# Altium project STC8H1K08.PrjPcb
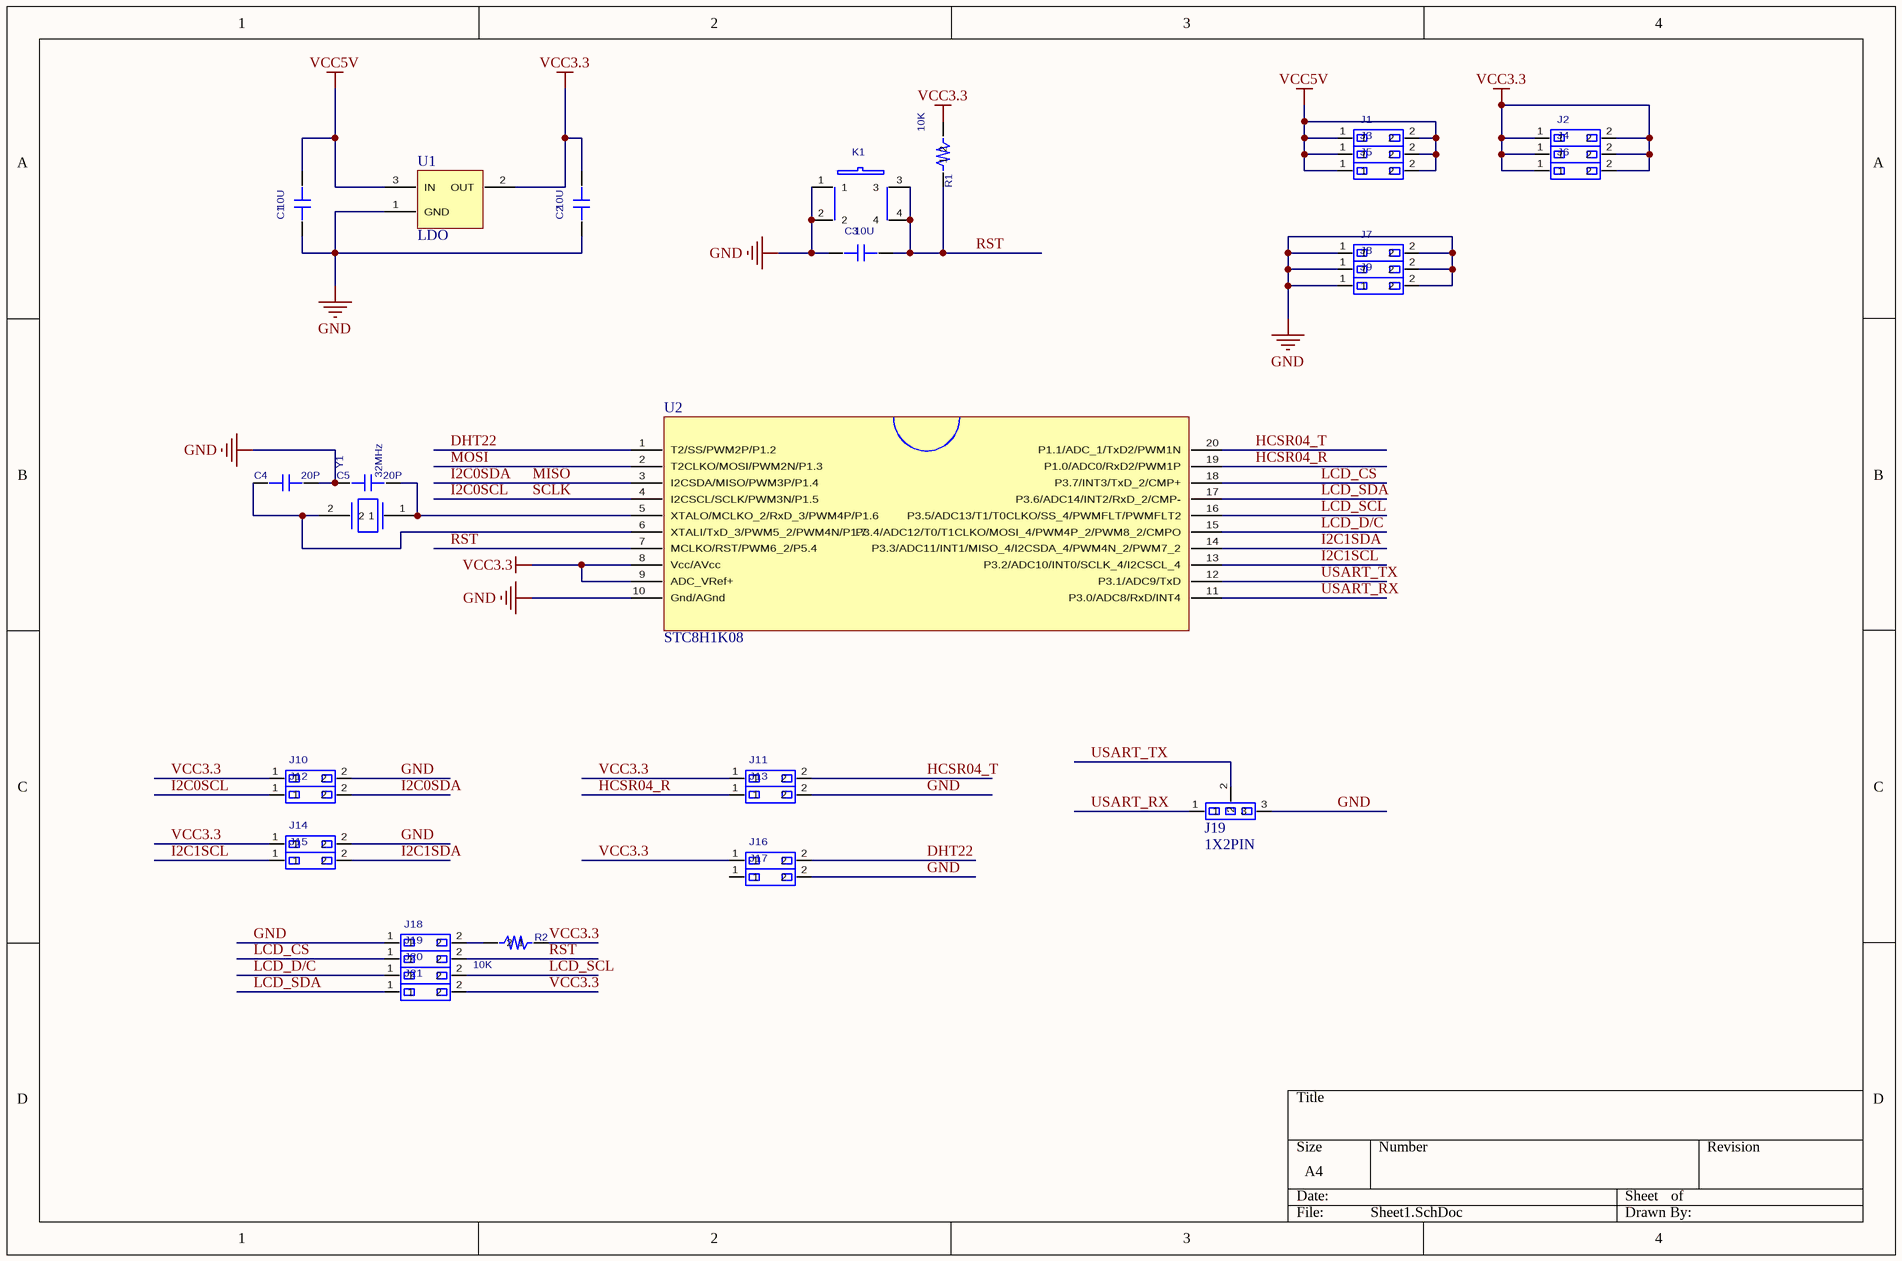
[diagram p0: Sheet1.SchDoc]
1 sheet, 33 parts. Net scope: global (net labels, ports and power ports of the same name join across sheets).
Board file: PCB1.PcbDoc

## Sheet Sheet1.SchDoc
size A4

### Parts
(Parts that share a designator on the sheet are numbered #1, #2 ... from top to bottom, then left to right.)
C1  value 10U  [CAP_0603_FIRE]  (hidden comment: C_10UF_0603)
C2  value 10U  [CAP_0603_FIRE]  (hidden comment: C_10UF_0603)
C3  value 10U  [CAP_0603_FIRE]  (hidden comment: C_10UF_0603)
C4  value 20P  [C_0603]  (hidden comment: C_20P_0603)
C5  value 20P  [C_0603]  (hidden comment: C_20P_0603)
J1  1X2PIN  [1X2PIN]  (value not drawn)
J2  1X2PIN  [1X2PIN]  (value not drawn)
J3  1X2PIN  [1X2PIN]  (value not drawn)
J4  1X2PIN  [1X2PIN]  (value not drawn)
J5  1X2PIN  [1X2PIN]  (value not drawn)
J6  1X2PIN  [1X2PIN]  (value not drawn)
J7  1X2PIN  [1X2PIN]  (value not drawn)
J8  1X2PIN  [1X2PIN]  (value not drawn)
J9  1X2PIN  [1X2PIN]  (value not drawn)
J10  1X2PIN  [1X2PIN]  (value not drawn)
J11  1X2PIN  [1X2PIN]  (value not drawn)
J12  1X2PIN  [1X2PIN]  (value not drawn)
J13  1X2PIN  [1X2PIN]  (value not drawn)
J14  1X2PIN  [1X2PIN]  (value not drawn)
J15  1X2PIN  [1X2PIN]  (value not drawn)
J16  1X2PIN  [1X2PIN]  (value not drawn)
J17  1X2PIN  [1X2PIN]  (value not drawn)
J18  1X2PIN  [1X2PIN]  (value not drawn)
J19#1  1X2PIN  [1X3PIN]
J19#2  1X2PIN  [1X2PIN]  (value not drawn)
J20  1X2PIN  [1X2PIN]  (value not drawn)
J21  1X2PIN  [1X2PIN]  (value not drawn)
K1  KEY  [SW6.2/6.2-SMD]  (value not drawn)
R1  value 10K  [RES_0603_FIRE]  (hidden comment: RES_10K_0603_FIRE)
R2  value 10K  [RES_0603_FIRE]  (hidden comment: RES_10K_0603_FIRE)
U1  LDO  [SOT-223]
U2  STC8H1K08  [TSSOP20]
Y1  value 32MHz  [XTAL]  (hidden comment: XTAL)

### Nets
GND: C1.1 C2.1 C3.1 C4.2 C5.1 J7.1 J7.2 J8.1 J8.2 J9.1 J9.2 J10.2 J13.2 J14.2 J17.2 J18.1 J19#1.3 K1.1 K1.2 U1.1(GND) U2.10(Gnd/AGnd)
VCC3.3: C2.2 J2.1 J2.2 J4.1 J4.2 J6.1 J6.2 J10.1 J11.1 J14.1 J16.1 J21.2 R1.2 R2.1 U1.2(OUT) U2.8(Vcc/AVcc) U2.9(ADC_VRef+)
VCC5V: C1.2 J1.1 J1.2 J3.1 J3.2 J5.1 J5.2 U1.3(IN)
DHT22: J16.2 U2.1(T2/SS/PWM2P/P1.2)
HCSR04_R: J13.1 U2.19(P1.0/ADC0/RxD2/PWM1P)
HCSR04_T: J11.2 U2.20(P1.1/ADC_1/TxD2/PWM1N)
I2C0SCL: J12.1 U2.4(I2CSCL/SCLK/PWM3N/P1.5)  [also labelled SCLK]
I2C0SDA: J12.2 U2.3(I2CSDA/MISO/PWM3P/P1.4)  [also labelled MISO]
I2C1SCL: J15.1 U2.13(P3.2/ADC10/INT0/SCLK_4/I2CSCL_4)
I2C1SDA: J15.2 U2.14(P3.3/ADC11/INT1/MISO_4/I2CSDA_4/PWM4N_2/PWM7_2)
LCD_CS: J19#2.1 U2.18(P3.7/INT3/TxD_2/CMP+)
LCD_D/C: J20.1 U2.15(P3.4/ADC12/T0/T1CLKO/MOSI_4/PWM4P_2/PWM8_2/CMPO)
LCD_SCL: J20.2 U2.16(P3.5/ADC13/T1/T0CLKO/SS_4/PWMFLT/PWMFLT2)
LCD_SDA: J21.1 U2.17(P3.6/ADC14/INT2/RxD_2/CMP-)
MOSI: U2.2(T2CLKO/MOSI/PWM2N/P1.3)
RST: C3.2 J19#2.2 K1.3 K1.4 R1.1 U2.7(MCLKO/RST/PWM6_2/P5.4)
USART_RX: J19#1.1 U2.11(P3.0/ADC8/RxD/INT4)
USART_TX: J19#1.2 U2.12(P3.1/ADC9/TxD)
NetC4_1: C4.1 U2.6(XTALI/TxD_3/PWM5_2/PWM4N/P1.7) Y1.2
NetC5_2: C5.2 U2.5(XTALO/MCLKO_2/RxD_3/PWM4P/P1.6) Y1.1
NetJ18_2: J18.2 R2.2

Not connected (* = marked no-connect by the designer): J17 1

### Library data of the parts
C4 C5 = C_22P_0603: PCB DECAL: C_0603
J19#1 = 1X3PIN
R1 R2 = RES_10K_0603_FIRE: SURFACE MOUNT RESISTOR 0.031 X 0.061 INCHES, 1/10W; Assembly: SMD; PCB DECAL: RES_0603_FIRE
U2 = STC8H1K08-36I-TSSOP20
Y1 = XTAL: CRYSTAL; PCB DECAL: CRYSTAL_SMD_FIRE
C1-C3 = C_10UF_0603: PCB DECAL: CAP_0603_FIRE
J1-J18 J19#2 J20 J21 = 1X2PIN: PCB DECAL: 1X2PIN
K1 = KEY: Manufacturer #1 PN: KEY; PCB DECAL: SW6.2/6.2-SMD